# Altium schematic sheet [4]_Connectors_&_IO.SchDoc: Connectors & I/O
size A3; Author: Eladio Delgado Mingorance; CompanyName: Mareldem Technologies; Organization: Mareldem Technologies; Revision: 1.0A; SheetNumber: 4; SheetTotal: 5
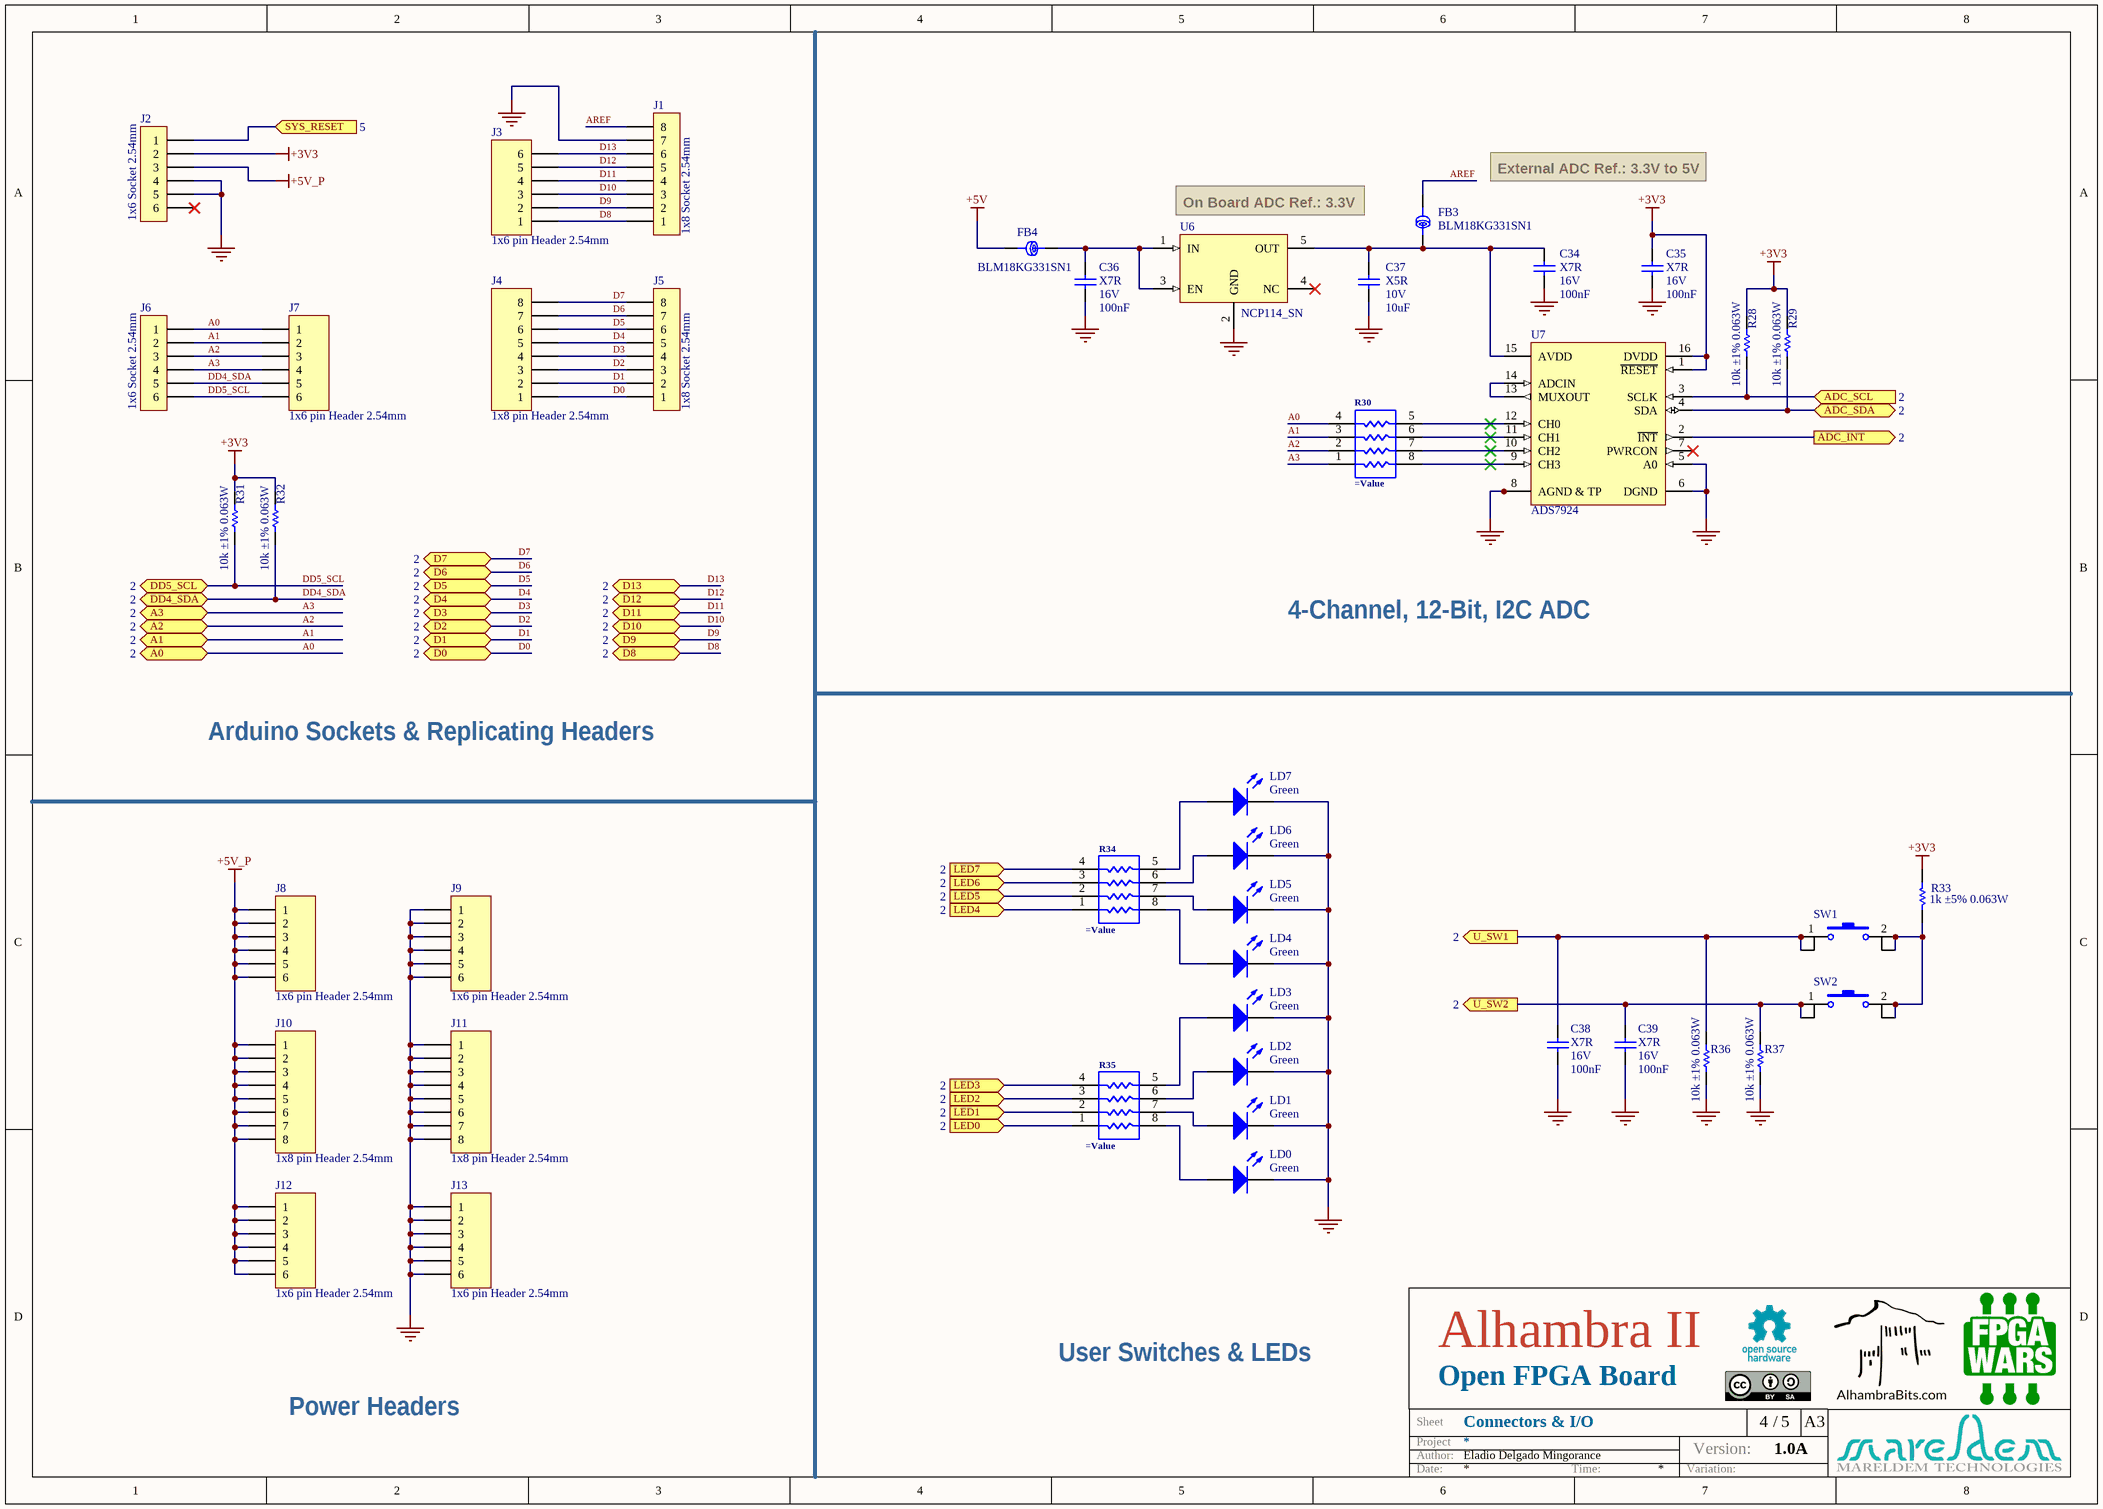
[diagram p0: [4]_Connectors_&_IO.SchDoc]

## Parts
C34  Dielectric: X7R  Voltage: 16V  Capacitance: 100nF  [C0402]  (hidden comment: Capacitor)
C35  Dielectric: X7R  Voltage: 16V  Capacitance: 100nF  [C0402]  (hidden comment: Capacitor)
C36  Dielectric: X7R  Voltage: 16V  Capacitance: 100nF  [C0402]  (hidden comment: Capacitor)
C37  Dielectric: X5R  Voltage: 10V  Capacitance: 10uF  [C0603]  (hidden comment: Capacitor)
C38  Dielectric: X7R  Voltage: 16V  Capacitance: 100nF  [C0402]  (hidden comment: Capacitor)
C39  Dielectric: X7R  Voltage: 16V  Capacitance: 100nF  [C0402]  (hidden comment: Capacitor)
FB3  BLM18KG331SN1  [L0603]
FB4  BLM18KG331SN1  [L0603]
J1  1x8 Socket 2.54mm  [1x8 Socket Header THT 2.54mm PIH]
J2  1x6 Socket 2.54mm  [1x6 Socket Header THT 2.54mm PIH]
J3  1x6 pin Header 2.54mm  [1x6 Pin Header 2.54 WHITE PIH]
J4  1x8 pin Header 2.54mm  [1x8 Pin Header 2.54 WHITE PIH]
J5  1x8 Socket 2.54mm  [1x8 Socket Header THT 2.54mm PIH]
J6  1x6 Socket 2.54mm  [1x6 Socket Header THT 2.54mm PIH]
J7  1x6 pin Header 2.54mm  [1x6 Pin Header 2.54 WHITE PIH]
J8  1x6 pin Header 2.54mm  [1x6 Pin Header 2.54 RED PIH]
J9  1x6 pin Header 2.54mm  [1x6 Pin Header 2.54 BLACK PIH]
J10  1x8 pin Header 2.54mm  [1x8 Pin Header 2.54 RED PIH]
J11  1x8 pin Header 2.54mm  [1x8 Pin Header 2.54 BLACK PIH]
J12  1x6 pin Header 2.54mm  [1x6 Pin Header 2.54 RED PIH]
J13  1x6 pin Header 2.54mm  [1x6 Pin Header 2.54 BLACK PIH]
LD0  Green  [LED0603]
LD1  Green  [LED0603]
LD2  Green  [LED0603]
LD3  Green  [LED0603]
LD4  Green  [LED0603]
LD5  Green  [LED0603]
LD6  Green  [LED0603]
LD7  Green  [LED0603]
R28  value 10k ±1% 0.063W  [R0402]  (hidden comment: Resistor)
R29  value 10k ±1% 0.063W  [R0402]  (hidden comment: Resistor)
R30  (no value)  [4xArray_1206_Convex]
R31  value 10k ±1% 0.063W  [R0402]  (hidden comment: Resistor)
R32  value 10k ±1% 0.063W  [R0402]  (hidden comment: Resistor)
R33  value 1k ±5% 0.063W  [R0402]  (hidden comment: Resistor)
R34  (no value)  [4xArray_1206_Convex]
R35  (no value)  [4xArray_1206_Convex]
R36  value 10k ±1% 0.063W  [R0402]  (hidden comment: Resistor)
R37  value 10k ±1% 0.063W  [R0402]  (hidden comment: Resistor)
SW1  Switch_4P_SP_1-3_4-2  [4363x30458xx]  (value not drawn)
SW2  Switch_4P_SP_1-3_4-2  [4363x30458xx]  (value not drawn)
U6  NCP114_SN  [SOT23-5_M]
U7  ADS7924  [QFN16]

## Ports
A0 (bidir, see 2), A1 (bidir, see 2), A2 (bidir, see 2), A3 (bidir, see 2), ADC_INT (out, see 2), ADC_SCL (in, see 2), ADC_SDA (bidir, see 2), D0 (bidir, see 2), D1 (bidir, see 2), D2 (bidir, see 2), D3 (bidir, see 2), D4 (bidir, see 2), D5 (bidir, see 2), D6 (bidir, see 2), D7 (bidir, see 2), D8 (bidir, see 2), D9 (bidir, see 2), D10 (bidir, see 2), D11 (bidir, see 2), D12 (bidir, see 2), D13 (bidir, see 2), DD4_SDA (bidir, see 2), DD5_SCL (bidir, see 2), LED0 (in, see 2), LED1 (in, see 2), LED2 (in, see 2), LED3 (in, see 2), LED4 (in, see 2), LED5 (in, see 2), LED6 (in, see 2), LED7 (in, see 2), SYS_RESET (in, see 5), U_SW1 (out, see 2), U_SW2 (out, see 2)

## Nets
+3V3: C35.2 J2.2 R28.2 R29.2 R31.2 R32.2 R33.1 U7.1(~{RESET}) U7.16(DVDD)
+5V: FB4.2
+5V_P: J2.3 J8.1 J8.2 J8.3 J8.4 J8.5 J8.6 J10.1 J10.2 J10.3 J10.4 J10.5 J10.6 J10.7 J10.8 J12.1 J12.2 J12.3 J12.4 J12.5 J12.6
GND: C34.2 C35.1 C36.1 C37.2 C38.1 C39.1 J1.7 J2.4 J2.5 J9.1 J9.2 J9.3 J9.4 J9.5 J9.6 J11.1 J11.2 J11.3 J11.4 J11.5 J11.6 J11.7 J11.8 J13.1 J13.2 J13.3 J13.4 J13.5 J13.6 LD0.K LD1.K LD2.K LD3.K LD4.K LD5.K LD6.K LD7.K R36.1 R37.1 U6.2(GND) U7.0(TP) U7.5(A0) U7.6(DGND) U7.8(AGND_&_TP)
A0: J6.1 J7.1 R30.4 ; port A0
A1: J6.2 J7.2 R30.3 ; port A1
A2: J6.3 J7.3 R30.2 ; port A2
A3: J6.4 J7.4 R30.1 ; port A3
ADC_INT: U7.2(~{INT}) ; port ADC_INT
ADC_SCL: R28.1 U7.3(SCLK) ; port ADC_SCL
ADC_SDA: R29.1 U7.4(SDA) ; port ADC_SDA
AREF: FB3.2 J1.8
D0: J4.1 J5.1 ; port D0
D1: J4.2 J5.2 ; port D1
D2: J4.3 J5.3 ; port D2
D3: J4.4 J5.4 ; port D3
D4: J4.5 J5.5 ; port D4
D5: J4.6 J5.6 ; port D5
D6: J4.7 J5.7 ; port D6
D7: J4.8 J5.8 ; port D7
D8: J1.1 J3.1 ; port D8
D9: J1.2 J3.2 ; port D9
D10: J1.3 J3.3 ; port D10
D11: J1.4 J3.4 ; port D11
D12: J1.5 J3.5 ; port D12
D13: J1.6 J3.6 ; port D13
DD4_SDA: J6.5 J7.5 R32.1 ; port DD4_SDA
DD5_SCL: J6.6 J7.6 R31.1 ; port DD5_SCL
LED0: R35.1 ; port LED0
LED1: R35.2 ; port LED1
LED2: R35.3 ; port LED2
LED3: R35.4 ; port LED3
LED4: R34.1 ; port LED4
LED5: R34.2 ; port LED5
LED6: R34.3 ; port LED6
LED7: R34.4 ; port LED7
SYS_RESET: J2.1 ; port SYS_RESET
U_SW1: C38.2 R36.2 SW1.1 SW1.3 ; port U_SW1
U_SW2: C39.2 R37.2 SW2.1 SW2.3 ; port U_SW2
NetC34_1: C34.1 C37.1 FB3.1 U6.5(OUT) U7.15(AVDD)
NetC36_2: C36.2 FB4.1 U6.1(IN) U6.3(EN)
NetLD0_A: LD0.A R35.8
NetLD1_A: LD1.A R35.7
NetLD2_A: LD2.A R35.6
NetLD3_A: LD3.A R35.5
NetLD4_A: LD4.A R34.8
NetLD5_A: LD5.A R34.7
NetLD6_A: LD6.A R34.6
NetLD7_A: LD7.A R34.5
NetR30_5: R30.5 U7.12(CH0)
NetR30_6: R30.6 U7.11(CH1)
NetR30_7: R30.7 U7.10(CH2)
NetR30_8: R30.8 U7.9(CH3)
NetR33_2: R33.2 SW1.2 SW1.4 SW2.2 SW2.4
NetU7_13: U7.13(MUXOUT) U7.14(ADCIN)

Not connected (* = marked no-connect by the designer): J2 6*; U6 4(NC)*; U7 7(PWRCON)*

## Notes on the sheet
- External ADC Ref.: 3.3V to 5V
- (near U6) On Board ADC Ref.: 3.3V
- 4-Channel, 12-Bit, I2C ADC
- Arduino Sockets & Replicating Headers
- User Switches & LEDs
- Power Headers
- Alhambra II
- Open FPGA Board
- Project
- Sheet
- Author:
- Version:
- /
- A3
- Date:
- Time:
- Variation:

## Library data of the parts
C34-C36 C38 C39 = C0402_100nF_16V_±10%: Capacitor SMD; Manufacturer: Kemet; Value: 100nF ±10% 16V; Tolerance: ±10%; OrderingCode: C0402C104K4RAC; Temp_ Max: 125; Temp_ Min: -55; Part Number: C0402_100nF_16V_±10%; Price (€): 0,05
C37 = C0603_10uF_10V_±10%: Capacitor SMD; Manufacturer: Murata; Value: 10uF ±10% 10V; Tolerance: ±10%; OrderingCode: GRM188R61A106KE69D; Temp_ Max: 85; Temp_ Min: -55; Part Number: C0603_10uF_10V_±10%; Price (€): 0,027
FB3 FB4 = L0603_330R_0,080R_1700 mA: Ferrite Bead; Manufacturer: Murata; Resistance_100MHz: 330R; Resistance_DC: 0,080R; Current: 1700 mA; Temp_ Max: 125; Temp_ Min: -55; Value: 330R 0,080R 1700 mA; Part Number: L0603_330R_0,080R_1700 mA; OrderingCode: BLM18KG331SN1; Price (€): 0,021
J1 = CON_SH_THT2.54_8 PIH: Connector, 8 pin Socket Header 2.54mm; Manufacturer: Samtec; OrderingCode: SSW-108-01-T-S; Temp_ Max: 125; Temp_ Min: -40; OrderingCode 2: 613 008 118 21; Value: 8 PIH; Pitch: 2.54mm; Part Number: CON_SH_THT2.54_8 PIH; Supplier: Samtec; Price (€): 0,438; Manufacturer 2: Würth Elektronik
J2 = CON_SH_THT2.54_6 PIH: Connector, 6 pin Socket Header 2.54mm; Manufacturer: Samtec; OrderingCode: SSW-106-01-T-S; Temp_ Max: 125; Temp_ Min: -40; OrderingCode 2: 613 006 118 21; Value: 6 PIH; Pitch: 2.54mm; Part Number: CON_SH_THT2.54_6 PIH; Supplier: Samtec; Price (€): 0,381; Manufacturer 2: Würth Elektronik
J3 J7 = CON_PH_THT2.54_6 Natural PIH: Connector, 1x6 pin Header 2.54mm; Manufacturer: Samtec; OrderingCode: HTSW-106-07-T-S-NATURAL; Temp_ Max: 105; Temp_ Min: -55; Pitch: 2.54mm; Part Number: CON_PH_THT2.54_6 Natural PIH; Supplier: Samtec; Price (€): 0,26
J4 = CON_PH_THT2.54_8 Natural PIH: Connector, 1x8 pin Header 2.54mm; Manufacturer: Samtec; OrderingCode: HTSW-108-07-T-S-NATURAL; Temp_ Max: 105; Temp_ Min: -55; Pitch: 2.54mm; Part Number: CON_PH_THT2.54_8 Natural PIH; Supplier: Samtec; Price (€): 0,35
J5 = CON_SH_THT2.54_8 PIH: Connector, 8 pin Socket Header 2.54mm; Manufacturer: Samtec; OrderingCode: SSW-108-01-T-S; Temp_ Max: 125; Temp_ Min: -40; Value: 8 PIH; OrderingCode 2: 613 008 118 21; Pitch: 2.54mm; Part Number: CON_SH_THT2.54_8 PIH; Supplier: Samtec; Price (€): 0,438; Manufacturer 2: Würth Elektronik
J6 = CON_SH_THT2.54_6 PIH: Connector, 6 pin Socket Header 2.54mm; Manufacturer: Samtec; OrderingCode: SSW-106-01-T-S; Temp_ Max: 125; Temp_ Min: -40; Value: 6 PIH; OrderingCode 2: 613 006 118 21; Pitch: 2.54mm; Part Number: CON_SH_THT2.54_6 PIH; Supplier: Samtec; Price (€): 0,381; Manufacturer 2: Würth Elektronik
J8 J12 = CON_PH_THT2.54_6 Red PIH: Connector, 1x6 pin Header 2.54mm; Manufacturer: Samtec; OrderingCode: HTSW-106-07-T-S-RED; Temp_ Max: 105; Temp_ Min: -55; Pitch: 2.54mm; Part Number: CON_PH_THT2.54_6 Red PIH; Supplier: Samtec; Price (€): 0,26
J9 J13 = CON_PH_THT2.54_6 Black PIH: Connector, 1x6 pin Header 2.54mm; Manufacturer: Samtec; OrderingCode: HTSW-106-07-T-S-BLACK; Temp_ Max: 105; Temp_ Min: -55; Pitch: 2.54mm; Part Number: CON_PH_THT2.54_6 Black PIH; Supplier: Samtec; Price (€): 0,26
J10 = CON_PH_THT2.54_8 Red PIH: Connector, 1x8 pin Header 2.54mm; Manufacturer: Samtec; OrderingCode: HTSW-108-07-T-S-RED; Temp_ Max: 105; Temp_ Min: -55; Pitch: 2.54mm; Part Number: CON_PH_THT2.54_8 Red PIH; Supplier: Samtec; Price (€): 0,35
J11 = CON_PH_THT2.54_8 Black PIH: Connector, 1x8 pin Header 2.54mm; Manufacturer: Samtec; OrderingCode: HTSW-108-07-T-S-BLACK; Temp_ Max: 105; Temp_ Min: -55; Pitch: 2.54mm; Part Number: CON_PH_THT2.54_8 Black PIH; Supplier: Samtec; Price (€): 0,35
LD0-LD7 = LED Green 0603 Wurth: LED; Manufacturer: WE; OrderingCode: 150 060 VS7 5000; Temp_ Max: 85; Temp_ Min: -40; Part Number: LED Green 0603 Wurth; Price (€): 0,07; Value: Green
R28 R29 R31 R32 R36 R37 = R0402_10k_0.063W_±1%: Resistor, SMD; Manufacturer: Vishay; Tolerance: ±1%; OrderingCode: CRCW040210K0FK; Power: 0.063W; Resistance: 10k; Temp_ Max: 155; Temp_ Min: -55; PackageDescription: SMD; Part Number: R0402_10k_0.063W_±1%; Price (€): 0,006
R30 = 4xArray_1206_Convex_100R_0,0625W_±5%: Resistor, Array 4x1; Manufacturer: Yageo; Resistance: 100R; Tolerance: ±5%; OrderingCode: YC164-JR-07100RL; Temp_ Max: 155; Temp_ Min: -55; Value: 100R ±5% 0,0625W; Part Number: 4xArray_1206_Convex_100R_0,0625W_±5%; Power: 0,0625W; Price (€): 0,006
R33 = R0402_1k_0.063W_±5%: Resistor, SMD; Manufacturer: Vishay; Tolerance: ±5%; OrderingCode: CRCW04021K00JN; Power: 0.063W; Resistance: 1k; Temp_ Max: 155; Temp_ Min: -55; PackageDescription: SMD; Part Number: R0402_1k_0.063W_±5%; Price (€): 0,003
R34 R35 = 4xArray_1206_Convex_470R_0,0625W_0,05: Resistor, Array 4x1; Manufacturer: Yageo; Resistance: 470R; Tolerance: 5%; OrderingCode: YC164-JR-07470RL; Temp_ Max: 155; Temp_ Min: -25; Value: 470R 5% 0,0625W; Part Number: 4xArray_1206_Convex_470R_0,0625W_0,05; Power: 0,0625W; Price (€): 0,006
SW1 SW2 = SW 4,7x3,5 mm SMD side push: Micro miniature pushbutton surface Switch; Manufacturer: WE; OrderingCode: 436353045816; Temp_ Max: 85; Temp_ Min: -40; Part Number: SW 4,7x3,5 mm SMD side push; Supplier: WE; Price (€): 0,2
U6 = NCP114: LDO Regulator, 5pin, SOT-23; Part Number: NCP114; Manufacturer: ON Semiconductor; Voltage IN: 1,7 - 5.5V; Voltage OUT: 3,3V; Current OUT: 300 mA; OrderingCode: NCP114BSN330T1G; Temp_ Max: 85; Temp_ Min: -40; OrderingCode 2: NCP114ASN330T1G; Price (€): 0,07
U7 = ADS7924: ADC Converter, 12-Bit, 4-Ch, I2C; Manufacturer: Texas Instruments; OrderingCode: ADS7924IRTER; Temp_ Max: 85; Temp_ Min: -40; Part Number: ADS7924; Supplier: Silica; Price (€): 1,35